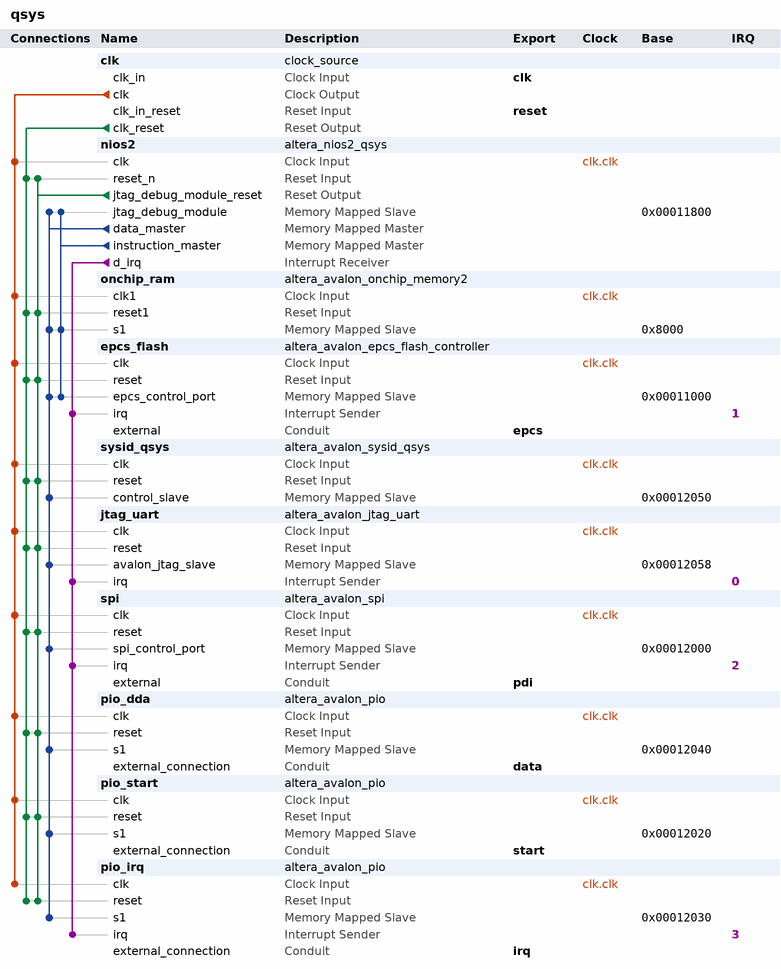
[diagram p0: system contents]
# Platform Designer (Qsys) system qsys, Cyclone IV GX EP4CGX75CF23I7
# Parameters at their usual value, and those the tool derives, are not listed.
package require -exact qsys 13.1
create_system qsys
set_project_property DEVICE_FAMILY {Cyclone IV GX}
set_project_property DEVICE EP4CGX75CF23I7

add_instance clk clock_source 13.1
set_instance_parameter_value clk clockFrequency 100000000

add_instance nios2 altera_nios2_qsys 13.1
set_instance_parameter_value nios2 muldiv_divider true
set_instance_parameter_value nios2 resetSlave epcs_flash.epcs_control_port
set_instance_parameter_value nios2 mmu_TLBMissExcSlave None
set_instance_parameter_value nios2 exceptionSlave onchip_ram.s1
set_instance_parameter_value nios2 breakSlave nios2.jtag_debug_module
set_instance_parameter_value nios2 impl Fast
set_instance_parameter_value nios2 icache_size 4096
set_instance_parameter_value nios2 dcache_size 4096

add_instance onchip_ram altera_avalon_onchip_memory2 13.1
set_instance_parameter_value onchip_ram dataWidth 32
set_instance_parameter_value onchip_ram dualPort false
set_instance_parameter_value onchip_ram initMemContent true
set_instance_parameter_value onchip_ram initializationFileName onchip_mem.hex
set_instance_parameter_value onchip_ram memorySize 30720

add_instance epcs_flash altera_avalon_epcs_flash_controller 13.1

add_instance sysid_qsys altera_avalon_sysid_qsys 13.1
set_instance_parameter_value sysid_qsys id 311

add_instance jtag_uart altera_avalon_jtag_uart 13.1
set_instance_parameter_value jtag_uart simInteractiveOptions NO_INTERACTIVE_WINDOWS

add_instance spi altera_avalon_spi 13.1
set_instance_parameter_value spi clockPhase 1
set_instance_parameter_value spi clockPolarity 1
set_instance_parameter_value spi dataWidth 8
set_instance_parameter_value spi insertDelayBetweenSlaveSelectAndSClk true
set_instance_parameter_value spi masterSPI true
set_instance_parameter_value spi numberOfSlaves 1
set_instance_parameter_value spi targetClockRate 15000000
set_instance_parameter_value spi targetSlaveSelectToSClkDelay 40.0

add_instance pio_dda altera_avalon_pio 13.1
set_instance_parameter_value pio_dda direction Output
set_instance_parameter_value pio_dda width 32

add_instance pio_start altera_avalon_pio 13.1
set_instance_parameter_value pio_start direction Output
set_instance_parameter_value pio_start width 1

add_instance pio_irq altera_avalon_pio 13.1
set_instance_parameter_value pio_irq captureEdge true
set_instance_parameter_value pio_irq direction Input
set_instance_parameter_value pio_irq edgeType FALLING
set_instance_parameter_value pio_irq generateIRQ true
set_instance_parameter_value pio_irq irqType EDGE
set_instance_parameter_value pio_irq width 1

# connections
add_connection clk.clk epcs_flash.clk clock
add_connection clk.clk jtag_uart.clk clock
add_connection clk.clk nios2.clk clock
add_connection clk.clk onchip_ram.clk1 clock
add_connection clk.clk pio_dda.clk clock
add_connection clk.clk pio_irq.clk clock
add_connection clk.clk pio_start.clk clock
add_connection clk.clk spi.clk clock
add_connection clk.clk sysid_qsys.clk clock
add_connection clk.clk_reset epcs_flash.reset reset
add_connection clk.clk_reset jtag_uart.reset reset
add_connection clk.clk_reset nios2.reset_n reset
add_connection clk.clk_reset onchip_ram.reset1 reset
add_connection clk.clk_reset pio_dda.reset reset
add_connection clk.clk_reset pio_irq.reset reset
add_connection clk.clk_reset pio_start.reset reset
add_connection clk.clk_reset spi.reset reset
add_connection clk.clk_reset sysid_qsys.reset reset
add_connection nios2.jtag_debug_module_reset epcs_flash.reset reset
add_connection nios2.jtag_debug_module_reset jtag_uart.reset reset
add_connection nios2.jtag_debug_module_reset nios2.reset_n reset
add_connection nios2.jtag_debug_module_reset onchip_ram.reset1 reset
add_connection nios2.jtag_debug_module_reset pio_dda.reset reset
add_connection nios2.jtag_debug_module_reset pio_irq.reset reset
add_connection nios2.jtag_debug_module_reset pio_start.reset reset
add_connection nios2.jtag_debug_module_reset spi.reset reset
add_connection nios2.jtag_debug_module_reset sysid_qsys.reset reset
add_connection nios2.data_master epcs_flash.epcs_control_port avalon
set_connection_parameter_value nios2.data_master/epcs_flash.epcs_control_port baseAddress 0x00011000
add_connection nios2.data_master jtag_uart.avalon_jtag_slave avalon
set_connection_parameter_value nios2.data_master/jtag_uart.avalon_jtag_slave baseAddress 0x00012058
add_connection nios2.data_master nios2.jtag_debug_module avalon
set_connection_parameter_value nios2.data_master/nios2.jtag_debug_module baseAddress 0x00011800
add_connection nios2.data_master onchip_ram.s1 avalon
set_connection_parameter_value nios2.data_master/onchip_ram.s1 baseAddress 0x8000
add_connection nios2.data_master pio_dda.s1 avalon
set_connection_parameter_value nios2.data_master/pio_dda.s1 baseAddress 0x00012040
add_connection nios2.data_master pio_irq.s1 avalon
set_connection_parameter_value nios2.data_master/pio_irq.s1 baseAddress 0x00012030
add_connection nios2.data_master pio_start.s1 avalon
set_connection_parameter_value nios2.data_master/pio_start.s1 baseAddress 0x00012020
add_connection nios2.data_master spi.spi_control_port avalon
set_connection_parameter_value nios2.data_master/spi.spi_control_port baseAddress 0x00012000
add_connection nios2.data_master sysid_qsys.control_slave avalon
set_connection_parameter_value nios2.data_master/sysid_qsys.control_slave baseAddress 0x00012050
add_connection nios2.instruction_master epcs_flash.epcs_control_port avalon
set_connection_parameter_value nios2.instruction_master/epcs_flash.epcs_control_port baseAddress 0x00011000
add_connection nios2.instruction_master nios2.jtag_debug_module avalon
set_connection_parameter_value nios2.instruction_master/nios2.jtag_debug_module baseAddress 0x00011800
add_connection nios2.instruction_master onchip_ram.s1 avalon
set_connection_parameter_value nios2.instruction_master/onchip_ram.s1 baseAddress 0x8000
add_connection nios2.d_irq epcs_flash.irq interrupt
set_connection_parameter_value nios2.d_irq/epcs_flash.irq irqNumber 1
add_connection nios2.d_irq jtag_uart.irq interrupt
set_connection_parameter_value nios2.d_irq/jtag_uart.irq irqNumber 0
add_connection nios2.d_irq pio_irq.irq interrupt
set_connection_parameter_value nios2.d_irq/pio_irq.irq irqNumber 3
add_connection nios2.d_irq spi.irq interrupt
set_connection_parameter_value nios2.d_irq/spi.irq irqNumber 2

# exported interfaces
add_interface clk clock sink
set_interface_property clk EXPORT_OF clk.clk_in
add_interface data conduit end
set_interface_property data EXPORT_OF pio_dda.external_connection
add_interface irq conduit end
set_interface_property irq EXPORT_OF pio_irq.external_connection
add_interface start conduit end
set_interface_property start EXPORT_OF pio_start.external_connection
add_interface epcs conduit end
set_interface_property epcs EXPORT_OF epcs_flash.external
add_interface pdi conduit end
set_interface_property pdi EXPORT_OF spi.external
add_interface reset reset sink
set_interface_property reset EXPORT_OF clk.clk_in_reset

set_interconnect_requirement {$system} qsys_mm.clockCrossingAdapter HANDSHAKE
set_interconnect_requirement {$system} qsys_mm.maxAdditionalLatency 1
set_interconnect_requirement {$system} qsys_mm.insertDefaultSlave false

save_system qsys.qsys
